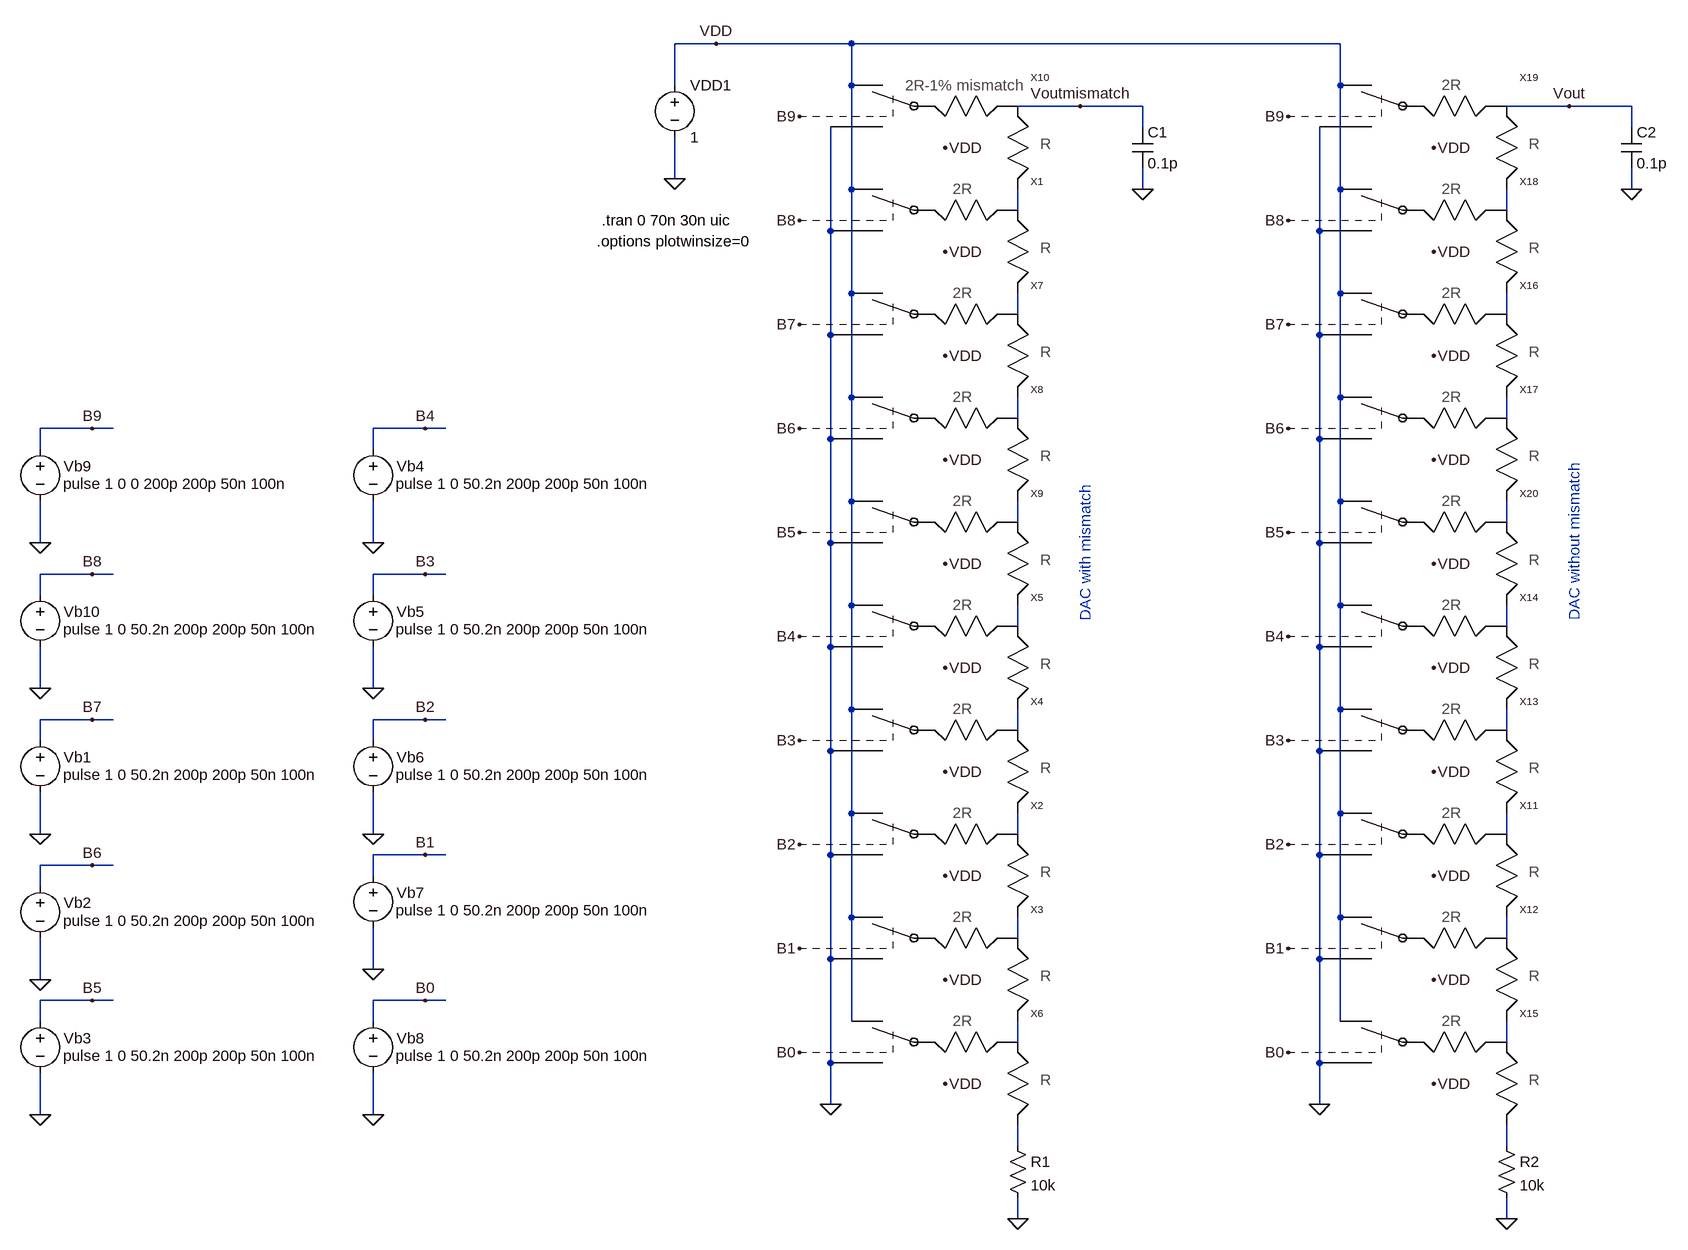
[diagram p0: schematic Fig30_16.asc]
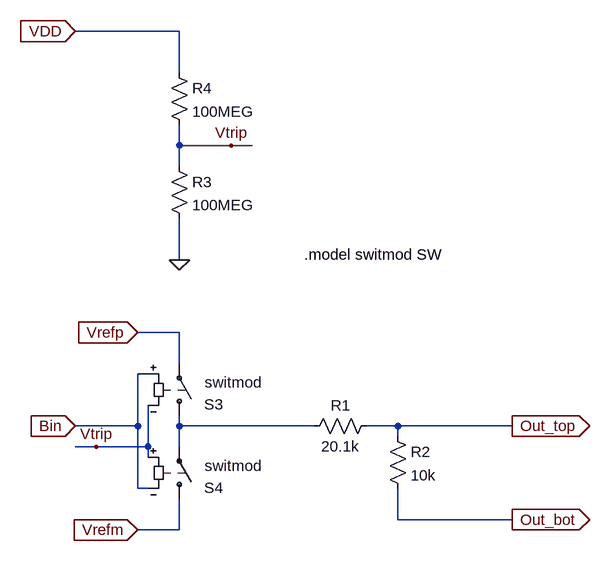
[diagram p1: sub-circuit adc_r_2r_bit_1%_mismatch.asc]
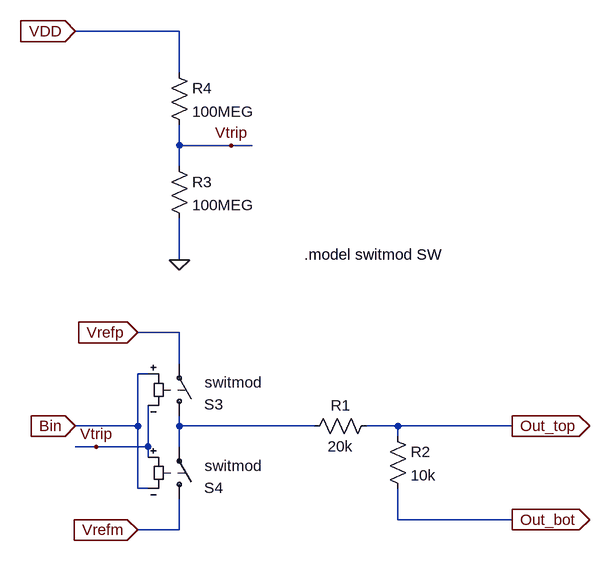
[diagram p2: sub-circuit adc_r_2r_bit.asc]
Fig30_16.asc, the LTspice schematic file:
Version 4
SHEET 1 2896 696
WIRE 1408 -2416 1344 -2416
WIRE 1616 -2416 1408 -2416
WIRE 2368 -2416 1616 -2416
WIRE 1344 -2352 1344 -2416
WIRE 1616 -2352 1616 -2416
WIRE 2368 -2352 2368 -2416
WIRE 1968 -2320 1872 -2320
WIRE 2064 -2320 1968 -2320
WIRE 2720 -2320 2624 -2320
WIRE 2816 -2320 2720 -2320
WIRE 2064 -2288 2064 -2320
WIRE 2816 -2288 2816 -2320
WIRE 1344 -2208 1344 -2272
WIRE 1616 -2192 1616 -2352
WIRE 2064 -2192 2064 -2224
WIRE 2368 -2192 2368 -2352
WIRE 2816 -2192 2816 -2224
WIRE 1872 -2160 1872 -2192
WIRE 2624 -2160 2624 -2192
WIRE 1584 -2128 1584 -2288
WIRE 2336 -2128 2336 -2288
WIRE 1616 -2032 1616 -2192
WIRE 2368 -2032 2368 -2192
WIRE 1872 -2000 1872 -2032
WIRE 2624 -2000 2624 -2032
WIRE 1584 -1968 1584 -2128
WIRE 2336 -1968 2336 -2128
WIRE 1616 -1872 1616 -2032
WIRE 2368 -1872 2368 -2032
WIRE 1872 -1840 1872 -1872
WIRE 2624 -1840 2624 -1872
WIRE 448 -1824 368 -1824
WIRE 480 -1824 448 -1824
WIRE 960 -1824 880 -1824
WIRE 992 -1824 960 -1824
WIRE 1584 -1808 1584 -1968
WIRE 2336 -1808 2336 -1968
WIRE 368 -1792 368 -1824
WIRE 880 -1792 880 -1824
WIRE 1616 -1712 1616 -1872
WIRE 2368 -1712 2368 -1872
WIRE 1872 -1680 1872 -1712
WIRE 2624 -1680 2624 -1712
WIRE 368 -1648 368 -1712
WIRE 880 -1648 880 -1712
WIRE 1584 -1648 1584 -1808
WIRE 2336 -1648 2336 -1808
WIRE 448 -1600 368 -1600
WIRE 480 -1600 448 -1600
WIRE 960 -1600 880 -1600
WIRE 992 -1600 960 -1600
WIRE 368 -1568 368 -1600
WIRE 880 -1568 880 -1600
WIRE 1616 -1552 1616 -1712
WIRE 2368 -1552 2368 -1712
WIRE 1872 -1520 1872 -1552
WIRE 2624 -1520 2624 -1552
WIRE 1584 -1488 1584 -1648
WIRE 2336 -1488 2336 -1648
WIRE 368 -1424 368 -1488
WIRE 880 -1424 880 -1488
WIRE 1616 -1392 1616 -1552
WIRE 2368 -1392 2368 -1552
WIRE 448 -1376 368 -1376
WIRE 480 -1376 448 -1376
WIRE 960 -1376 880 -1376
WIRE 992 -1376 960 -1376
WIRE 1872 -1360 1872 -1392
WIRE 2624 -1360 2624 -1392
WIRE 368 -1344 368 -1376
WIRE 880 -1344 880 -1376
WIRE 1584 -1328 1584 -1488
WIRE 2336 -1328 2336 -1488
WIRE 1616 -1232 1616 -1392
WIRE 2368 -1232 2368 -1392
WIRE 368 -1200 368 -1264
WIRE 880 -1200 880 -1264
WIRE 1872 -1200 1872 -1232
WIRE 2624 -1200 2624 -1232
WIRE 960 -1168 880 -1168
WIRE 992 -1168 960 -1168
WIRE 1584 -1168 1584 -1328
WIRE 2336 -1168 2336 -1328
WIRE 448 -1152 368 -1152
WIRE 480 -1152 448 -1152
WIRE 880 -1136 880 -1168
WIRE 368 -1120 368 -1152
WIRE 1616 -1072 1616 -1232
WIRE 2368 -1072 2368 -1232
WIRE 1872 -1040 1872 -1072
WIRE 2624 -1040 2624 -1072
WIRE 1584 -1008 1584 -1168
WIRE 2336 -1008 2336 -1168
WIRE 880 -992 880 -1056
WIRE 368 -976 368 -1040
WIRE 448 -944 368 -944
WIRE 480 -944 448 -944
WIRE 960 -944 880 -944
WIRE 992 -944 960 -944
WIRE 368 -912 368 -944
WIRE 880 -912 880 -944
WIRE 1616 -912 1616 -1072
WIRE 2368 -912 2368 -1072
WIRE 1872 -880 1872 -912
WIRE 2624 -880 2624 -912
WIRE 1584 -848 1584 -1008
WIRE 2336 -848 2336 -1008
WIRE 1584 -784 1584 -848
WIRE 2336 -784 2336 -848
WIRE 368 -768 368 -832
WIRE 880 -768 880 -832
WIRE 1872 -720 1872 -752
WIRE 2624 -720 2624 -752
WIRE 1872 -608 1872 -640
WIRE 2624 -608 2624 -640
FLAG 2064 -2192 0
FLAG 368 -1200 0
FLAG 448 -1376 B7
FLAG 368 -976 0
FLAG 448 -1152 B6
FLAG 368 -768 0
FLAG 448 -944 B5
FLAG 880 -1648 0
FLAG 960 -1824 B4
FLAG 880 -1424 0
FLAG 960 -1600 B3
FLAG 880 -1200 0
FLAG 960 -1376 B2
FLAG 880 -992 0
FLAG 960 -1168 B1
FLAG 880 -768 0
FLAG 960 -944 B0
FLAG 1344 -2208 0
FLAG 1408 -2416 VDD
FLAG 1760 -2096 VDD
FLAG 1760 -2256 VDD
FLAG 1536 -2304 B9
FLAG 1536 -2144 B8
FLAG 1968 -2320 Voutmismatch
FLAG 368 -1648 0
FLAG 448 -1824 B9
FLAG 368 -1424 0
FLAG 448 -1600 B8
FLAG 2624 -608 0
FLAG 2336 -784 0
FLAG 2512 -816 VDD
FLAG 2512 -976 VDD
FLAG 2512 -1136 VDD
FLAG 2512 -1296 VDD
FLAG 2512 -1456 VDD
FLAG 2816 -2192 0
FLAG 2288 -1504 B4
FLAG 2288 -1344 B3
FLAG 2288 -1184 B2
FLAG 2288 -1024 B1
FLAG 2288 -864 B0
FLAG 2512 -1616 VDD
FLAG 2512 -1776 VDD
FLAG 2512 -1936 VDD
FLAG 2512 -2096 VDD
FLAG 2512 -2256 VDD
FLAG 2288 -2304 B9
FLAG 2288 -2144 B8
FLAG 2288 -1984 B7
FLAG 2288 -1824 B6
FLAG 2288 -1664 B5
FLAG 2720 -2320 Vout
FLAG 1872 -608 0
FLAG 1584 -784 0
FLAG 1760 -816 VDD
FLAG 1760 -976 VDD
FLAG 1760 -1136 VDD
FLAG 1760 -1296 VDD
FLAG 1760 -1456 VDD
FLAG 1536 -1504 B4
FLAG 1536 -1344 B3
FLAG 1536 -1184 B2
FLAG 1536 -1024 B1
FLAG 1536 -864 B0
FLAG 1760 -1616 VDD
FLAG 1760 -1776 VDD
FLAG 1760 -1936 VDD
FLAG 1536 -1984 B7
FLAG 1536 -1824 B6
FLAG 1536 -1664 B5
SYMBOL cap 2048 -2288 R0
SYMATTR InstName C1
SYMATTR Value 0.1p
SYMBOL voltage 368 -1360 R0
WINDOW 0 36 42 Left 0
WINDOW 3 35 69 Left 0
WINDOW 123 0 0 Left 0
WINDOW 39 0 0 Left 0
SYMATTR InstName Vb1
SYMATTR Value pulse 1 0 50.2n 200p 200p 50n 100n
SYMBOL voltage 368 -1136 R0
WINDOW 0 36 42 Left 0
WINDOW 3 35 69 Left 0
WINDOW 123 0 0 Left 0
WINDOW 39 0 0 Left 0
SYMATTR InstName Vb2
SYMATTR Value pulse 1 0 50.2n 200p 200p 50n 100n
SYMBOL voltage 368 -928 R0
WINDOW 0 36 42 Left 0
WINDOW 3 35 69 Left 0
WINDOW 123 0 0 Left 0
WINDOW 39 0 0 Left 0
SYMATTR InstName Vb3
SYMATTR Value pulse 1 0 50.2n 200p 200p 50n 100n
SYMBOL voltage 880 -1808 R0
WINDOW 0 36 42 Left 0
WINDOW 3 35 69 Left 0
WINDOW 123 0 0 Left 0
WINDOW 39 0 0 Left 0
SYMATTR InstName Vb4
SYMATTR Value pulse 1 0 50.2n 200p 200p 50n 100n
SYMBOL voltage 880 -1584 R0
WINDOW 0 36 42 Left 0
WINDOW 3 35 69 Left 0
WINDOW 123 0 0 Left 0
WINDOW 39 0 0 Left 0
SYMATTR InstName Vb5
SYMATTR Value pulse 1 0 50.2n 200p 200p 50n 100n
SYMBOL voltage 880 -1360 R0
WINDOW 0 36 42 Left 0
WINDOW 3 35 69 Left 0
WINDOW 123 0 0 Left 0
WINDOW 39 0 0 Left 0
SYMATTR InstName Vb6
SYMATTR Value pulse 1 0 50.2n 200p 200p 50n 100n
SYMBOL voltage 880 -1152 R0
WINDOW 0 36 42 Left 0
WINDOW 3 35 69 Left 0
WINDOW 123 0 0 Left 0
WINDOW 39 0 0 Left 0
SYMATTR InstName Vb7
SYMATTR Value pulse 1 0 50.2n 200p 200p 50n 100n
SYMBOL voltage 880 -928 R0
WINDOW 0 36 42 Left 0
WINDOW 3 35 69 Left 0
WINDOW 123 0 0 Left 0
WINDOW 39 0 0 Left 0
SYMATTR InstName Vb8
SYMATTR Value pulse 1 0 50.2n 200p 200p 50n 100n
SYMBOL voltage 1344 -2368 R0
WINDOW 123 0 0 Left 0
WINDOW 39 0 0 Left 0
SYMATTR InstName VDD1
SYMATTR Value 1
SYMBOL voltage 368 -1808 R0
WINDOW 0 36 42 Left 0
WINDOW 3 35 69 Left 0
WINDOW 123 0 0 Left 0
WINDOW 39 0 0 Left 0
SYMATTR InstName Vb9
SYMATTR Value pulse 1 0 0 200p 200p 50n 100n
SYMBOL voltage 368 -1584 R0
WINDOW 0 36 42 Left 0
WINDOW 3 35 69 Left 0
WINDOW 123 0 0 Left 0
WINDOW 39 0 0 Left 0
SYMATTR InstName Vb10
SYMATTR Value pulse 1 0 50.2n 200p 200p 50n 100n
SYMBOL ADC_R_2R_bit_1%_mismatch 1584 -2320 R0
SYMATTR InstName X10
SYMBOL ADC_R_2R_bit 2336 -1200 R0
SYMATTR InstName X11
SYMBOL ADC_R_2R_bit 2336 -1040 R0
SYMATTR InstName X12
SYMBOL ADC_R_2R_bit 2336 -1360 R0
SYMATTR InstName X13
SYMBOL ADC_R_2R_bit 2336 -1520 R0
SYMATTR InstName X14
SYMBOL ADC_R_2R_bit 2336 -880 R0
SYMATTR InstName X15
SYMBOL res 2608 -736 R0
SYMATTR InstName R2
SYMATTR Value 10k
SYMBOL cap 2800 -2288 R0
SYMATTR InstName C2
SYMATTR Value 0.1p
SYMBOL ADC_R_2R_bit 2336 -2000 R0
SYMATTR InstName X16
SYMBOL ADC_R_2R_bit 2336 -1840 R0
SYMATTR InstName X17
SYMBOL ADC_R_2R_bit 2336 -2160 R0
SYMATTR InstName X18
SYMBOL ADC_R_2R_bit 2336 -2320 R0
SYMATTR InstName X19
SYMBOL ADC_R_2R_bit 2336 -1680 R0
SYMATTR InstName X20
SYMBOL ADC_R_2R_bit 1584 -2160 R0
SYMATTR InstName X1
SYMBOL ADC_R_2R_bit 1584 -1200 R0
SYMATTR InstName X2
SYMBOL ADC_R_2R_bit 1584 -1040 R0
SYMATTR InstName X3
SYMBOL ADC_R_2R_bit 1584 -1360 R0
SYMATTR InstName X4
SYMBOL ADC_R_2R_bit 1584 -1520 R0
SYMATTR InstName X5
SYMBOL ADC_R_2R_bit 1584 -880 R0
SYMATTR InstName X6
SYMBOL res 1856 -736 R0
SYMATTR InstName R1
SYMATTR Value 10k
SYMBOL ADC_R_2R_bit 1584 -2000 R0
SYMATTR InstName X7
SYMBOL ADC_R_2R_bit 1584 -1840 R0
SYMATTR InstName X8
SYMBOL ADC_R_2R_bit 1584 -1680 R0
SYMATTR InstName X9
TEXT 1232 -2144 Left 0 !.tran 0 70n 30n uic
TEXT 2728 -1528 VLeft 0 ;DAC without mismatch
TEXT 1976 -1528 VLeft 0 ;DAC with mismatch
TEXT 1224 -2112 Left 0 !.options plotwinsize=0

adc_r_2r_bit_1%_mismatch.asc, the sub-circuit schematic file:
Version 4
SHEET 1 2740 696
WIRE 944 -752 912 -752
WIRE 1008 -784 912 -784
WIRE 1008 -784 1008 -864
WIRE 1008 -688 1008 -784
WIRE 1024 -864 1008 -864
WIRE 1024 -752 944 -752
WIRE 1024 -752 1024 -816
WIRE 1024 -736 1024 -752
WIRE 1024 -688 1008 -688
WIRE 1072 -1392 912 -1392
WIRE 1072 -1328 1072 -1392
WIRE 1072 -1216 1072 -1248
WIRE 1072 -1184 1072 -1216
WIRE 1072 -1040 1072 -1104
WIRE 1072 -928 1008 -928
WIRE 1072 -880 1072 -928
WIRE 1072 -784 1072 -800
WIRE 1072 -752 1072 -784
WIRE 1072 -624 1008 -624
WIRE 1072 -624 1072 -672
WIRE 1152 -1216 1072 -1216
WIRE 1184 -1216 1152 -1216
WIRE 1280 -784 1072 -784
WIRE 1408 -784 1360 -784
WIRE 1408 -768 1408 -784
WIRE 1408 -640 1408 -688
WIRE 1584 -784 1408 -784
WIRE 1584 -640 1408 -640
FLAG 1152 -1216 Vtrip
FLAG 1072 -1040 0
FLAG 912 -1392 VDD
IOPIN 912 -1392 In
FLAG 1008 -624 Vrefm
IOPIN 1008 -624 In
FLAG 1008 -928 Vrefp
IOPIN 1008 -928 In
FLAG 912 -784 Bin
IOPIN 912 -784 In
FLAG 1584 -784 Out_top
IOPIN 1584 -784 Out
FLAG 1584 -640 Out_bot
IOPIN 1584 -640 Out
FLAG 944 -752 Vtrip
SYMBOL sw 1072 -784 M180
WINDOW 3 24 -12 Left 0
WINDOW 38 39 67 Left 0
WINDOW 0 38 33 Left 0
SYMATTR Value ""
SYMATTR SpiceModel switmod
SYMATTR InstName S3
SYMBOL sw 1072 -656 M180
WINDOW 3 24 -12 Left 0
WINDOW 38 39 67 Left 0
WINDOW 0 38 33 Left 0
SYMATTR Value ""
SYMATTR SpiceModel switmod
SYMATTR InstName S4
SYMBOL res 1376 -800 R90
WINDOW 0 0 56 VBottom 0
WINDOW 3 32 56 VTop 0
SYMATTR InstName R1
SYMATTR Value 20.1k
SYMBOL res 1392 -784 R0
SYMATTR InstName R2
SYMATTR Value 10k
SYMBOL res 1056 -1200 R0
SYMATTR InstName R3
SYMATTR Value 100MEG
SYMBOL res 1056 -1344 R0
SYMATTR InstName R4
SYMATTR Value 100MEG
TEXT 1264 -1048 Left 0 !.model switmod SW

adc_r_2r_bit.asc, the sub-circuit schematic file:
Version 4
SHEET 1 2740 696
WIRE 944 -752 912 -752
WIRE 1008 -784 912 -784
WIRE 1008 -784 1008 -864
WIRE 1008 -688 1008 -784
WIRE 1024 -864 1008 -864
WIRE 1024 -752 944 -752
WIRE 1024 -752 1024 -816
WIRE 1024 -736 1024 -752
WIRE 1024 -688 1008 -688
WIRE 1072 -1392 912 -1392
WIRE 1072 -1328 1072 -1392
WIRE 1072 -1216 1072 -1248
WIRE 1072 -1184 1072 -1216
WIRE 1072 -1040 1072 -1104
WIRE 1072 -928 1008 -928
WIRE 1072 -880 1072 -928
WIRE 1072 -784 1072 -800
WIRE 1072 -752 1072 -784
WIRE 1072 -624 1008 -624
WIRE 1072 -624 1072 -672
WIRE 1152 -1216 1072 -1216
WIRE 1184 -1216 1152 -1216
WIRE 1280 -784 1072 -784
WIRE 1408 -784 1360 -784
WIRE 1408 -768 1408 -784
WIRE 1408 -640 1408 -688
WIRE 1584 -784 1408 -784
WIRE 1584 -640 1408 -640
FLAG 1152 -1216 Vtrip
FLAG 1072 -1040 0
FLAG 912 -1392 VDD
IOPIN 912 -1392 In
FLAG 1008 -624 Vrefm
IOPIN 1008 -624 In
FLAG 1008 -928 Vrefp
IOPIN 1008 -928 In
FLAG 912 -784 Bin
IOPIN 912 -784 In
FLAG 1584 -784 Out_top
IOPIN 1584 -784 Out
FLAG 1584 -640 Out_bot
IOPIN 1584 -640 Out
FLAG 944 -752 Vtrip
SYMBOL sw 1072 -784 M180
WINDOW 3 24 -12 Left 0
WINDOW 38 39 67 Left 0
WINDOW 0 38 33 Left 0
SYMATTR Value ""
SYMATTR SpiceModel switmod
SYMATTR InstName S3
SYMBOL sw 1072 -656 M180
WINDOW 3 24 -12 Left 0
WINDOW 38 39 67 Left 0
WINDOW 0 38 33 Left 0
SYMATTR Value ""
SYMATTR SpiceModel switmod
SYMATTR InstName S4
SYMBOL res 1376 -800 R90
WINDOW 0 0 56 VBottom 0
WINDOW 3 32 56 VTop 0
SYMATTR InstName R1
SYMATTR Value 20k
SYMBOL res 1392 -784 R0
SYMATTR InstName R2
SYMATTR Value 10k
SYMBOL res 1056 -1200 R0
SYMATTR InstName R3
SYMATTR Value 100MEG
SYMBOL res 1056 -1344 R0
SYMATTR InstName R4
SYMATTR Value 100MEG
TEXT 1264 -1048 Left 0 !.model switmod SW

The netlist it stands for:
* Fig30_16.asc
C1 Voutmismatch 0 0.1p
Vb1 B7 0 pulse 1 0 50.2n 200p 200p 50n 100n
Vb2 B6 0 pulse 1 0 50.2n 200p 200p 50n 100n
Vb3 B5 0 pulse 1 0 50.2n 200p 200p 50n 100n
Vb4 B4 0 pulse 1 0 50.2n 200p 200p 50n 100n
Vb5 B3 0 pulse 1 0 50.2n 200p 200p 50n 100n
Vb6 B2 0 pulse 1 0 50.2n 200p 200p 50n 100n
Vb7 B1 0 pulse 1 0 50.2n 200p 200p 50n 100n
Vb8 B0 0 pulse 1 0 50.2n 200p 200p 50n 100n
VDD1 VDD 0 1
Vb9 B9 0 pulse 1 0 0 200p 200p 50n 100n
Vb10 B8 0 pulse 1 0 50.2n 200p 200p 50n 100n
XX10 VDD 0 Voutmismatch B9 VDD N001 adc_r_2r_bit_1%_mismatch
XX11 VDD 0 N014 B2 VDD N016 adc_r_2r_bit
XX12 VDD 0 N016 B1 VDD N018 adc_r_2r_bit
XX13 VDD 0 N012 B3 VDD N014 adc_r_2r_bit
XX14 VDD 0 N010 B4 VDD N012 adc_r_2r_bit
XX15 VDD 0 N018 B0 VDD N020 adc_r_2r_bit
R2 N020 0 10k
C2 Vout 0 0.1p
XX16 VDD 0 N004 B7 VDD N006 adc_r_2r_bit
XX17 VDD 0 N006 B6 VDD N008 adc_r_2r_bit
XX18 VDD 0 N002 B8 VDD N004 adc_r_2r_bit
XX19 VDD 0 Vout B9 VDD N002 adc_r_2r_bit
XX20 VDD 0 N008 B5 VDD N010 adc_r_2r_bit
XX1 VDD 0 N001 B8 VDD N003 adc_r_2r_bit
XX2 VDD 0 N013 B2 VDD N015 adc_r_2r_bit
XX3 VDD 0 N015 B1 VDD N017 adc_r_2r_bit
XX4 VDD 0 N011 B3 VDD N013 adc_r_2r_bit
XX5 VDD 0 N009 B4 VDD N011 adc_r_2r_bit
XX6 VDD 0 N017 B0 VDD N019 adc_r_2r_bit
R1 N019 0 10k
XX7 VDD 0 N003 B7 VDD N005 adc_r_2r_bit
XX8 VDD 0 N005 B6 VDD N007 adc_r_2r_bit
XX9 VDD 0 N007 B5 VDD N009 adc_r_2r_bit

* block symbol definitions
.subckt adc_r_2r_bit_1%_mismatch Vrefp Vrefm Out_top bin VDD Out_bot
S3 N001 Vrefp Bin Vtrip switmod
S4 Vrefm N001 Vtrip Bin switmod
R1 Out_top N001 20.1k
R2 Out_top Out_bot 10k
R3 Vtrip 0 100MEG
R4 VDD Vtrip 100MEG
.model switmod SW
.ends adc_r_2r_bit_1%_mismatch

.subckt adc_r_2r_bit Vrefp Vrefm Out_top bin VDD Out_bot
S3 N001 Vrefp Bin Vtrip switmod
S4 Vrefm N001 Vtrip Bin switmod
R1 Out_top N001 20k
R2 Out_top Out_bot 10k
R3 Vtrip 0 100MEG
R4 VDD Vtrip 100MEG
.model switmod SW
.ends adc_r_2r_bit

.tran 0 70n 30n uic
* DAC without mismatch
* DAC with mismatch
.options plotwinsize=0
.backanno
.end